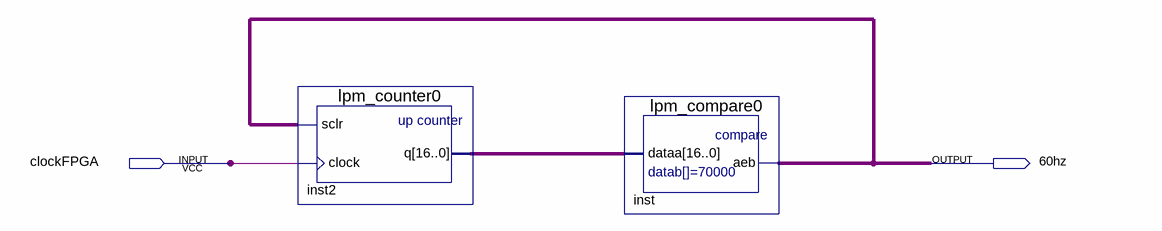
[diagram p0: schematic sheet]
// Quartus schematic frecuencia60hz.bdf as structural Verilog: 2 symbols, 2 pins
module frecuencia60hz (
  input  clockFPGA,
  output \60hz 
);

  wire [16:0] inst2_q;

  lpm_counter0 inst2 (.sclr(\60hz ), .clock(clockFPGA), .q(inst2_q));
  lpm_compare0 inst (.dataa(inst2_q), .aeb(\60hz ));
endmodule
